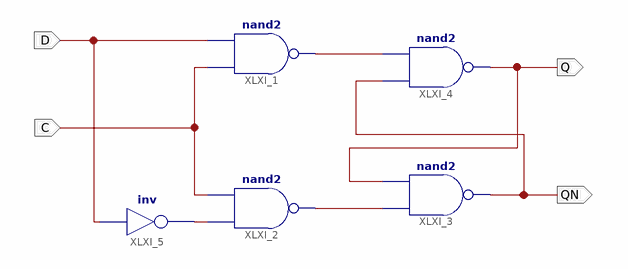
[diagram p0: schematic sheet 1]
// Xilinx ISE schematic D_LATCH.sch (kintex7) as structural Verilog: 5 symbols, 4 ports
module D_LATCH (
  input  D,
  input  C,
  output Q,
  output QN
);

  wire XLXN_1, XLXN_7, XLXN_8;

  nand XLXI_1 (XLXN_7, C, D);
  nand XLXI_2 (XLXN_8, XLXN_1, C);
  nand XLXI_3 (QN, XLXN_8, Q);
  nand XLXI_4 (Q, QN, XLXN_7);
  not XLXI_5 (XLXN_1, D);
endmodule
